# EAGLE schematic Shield_v1 (EAGLE 7.6.0)
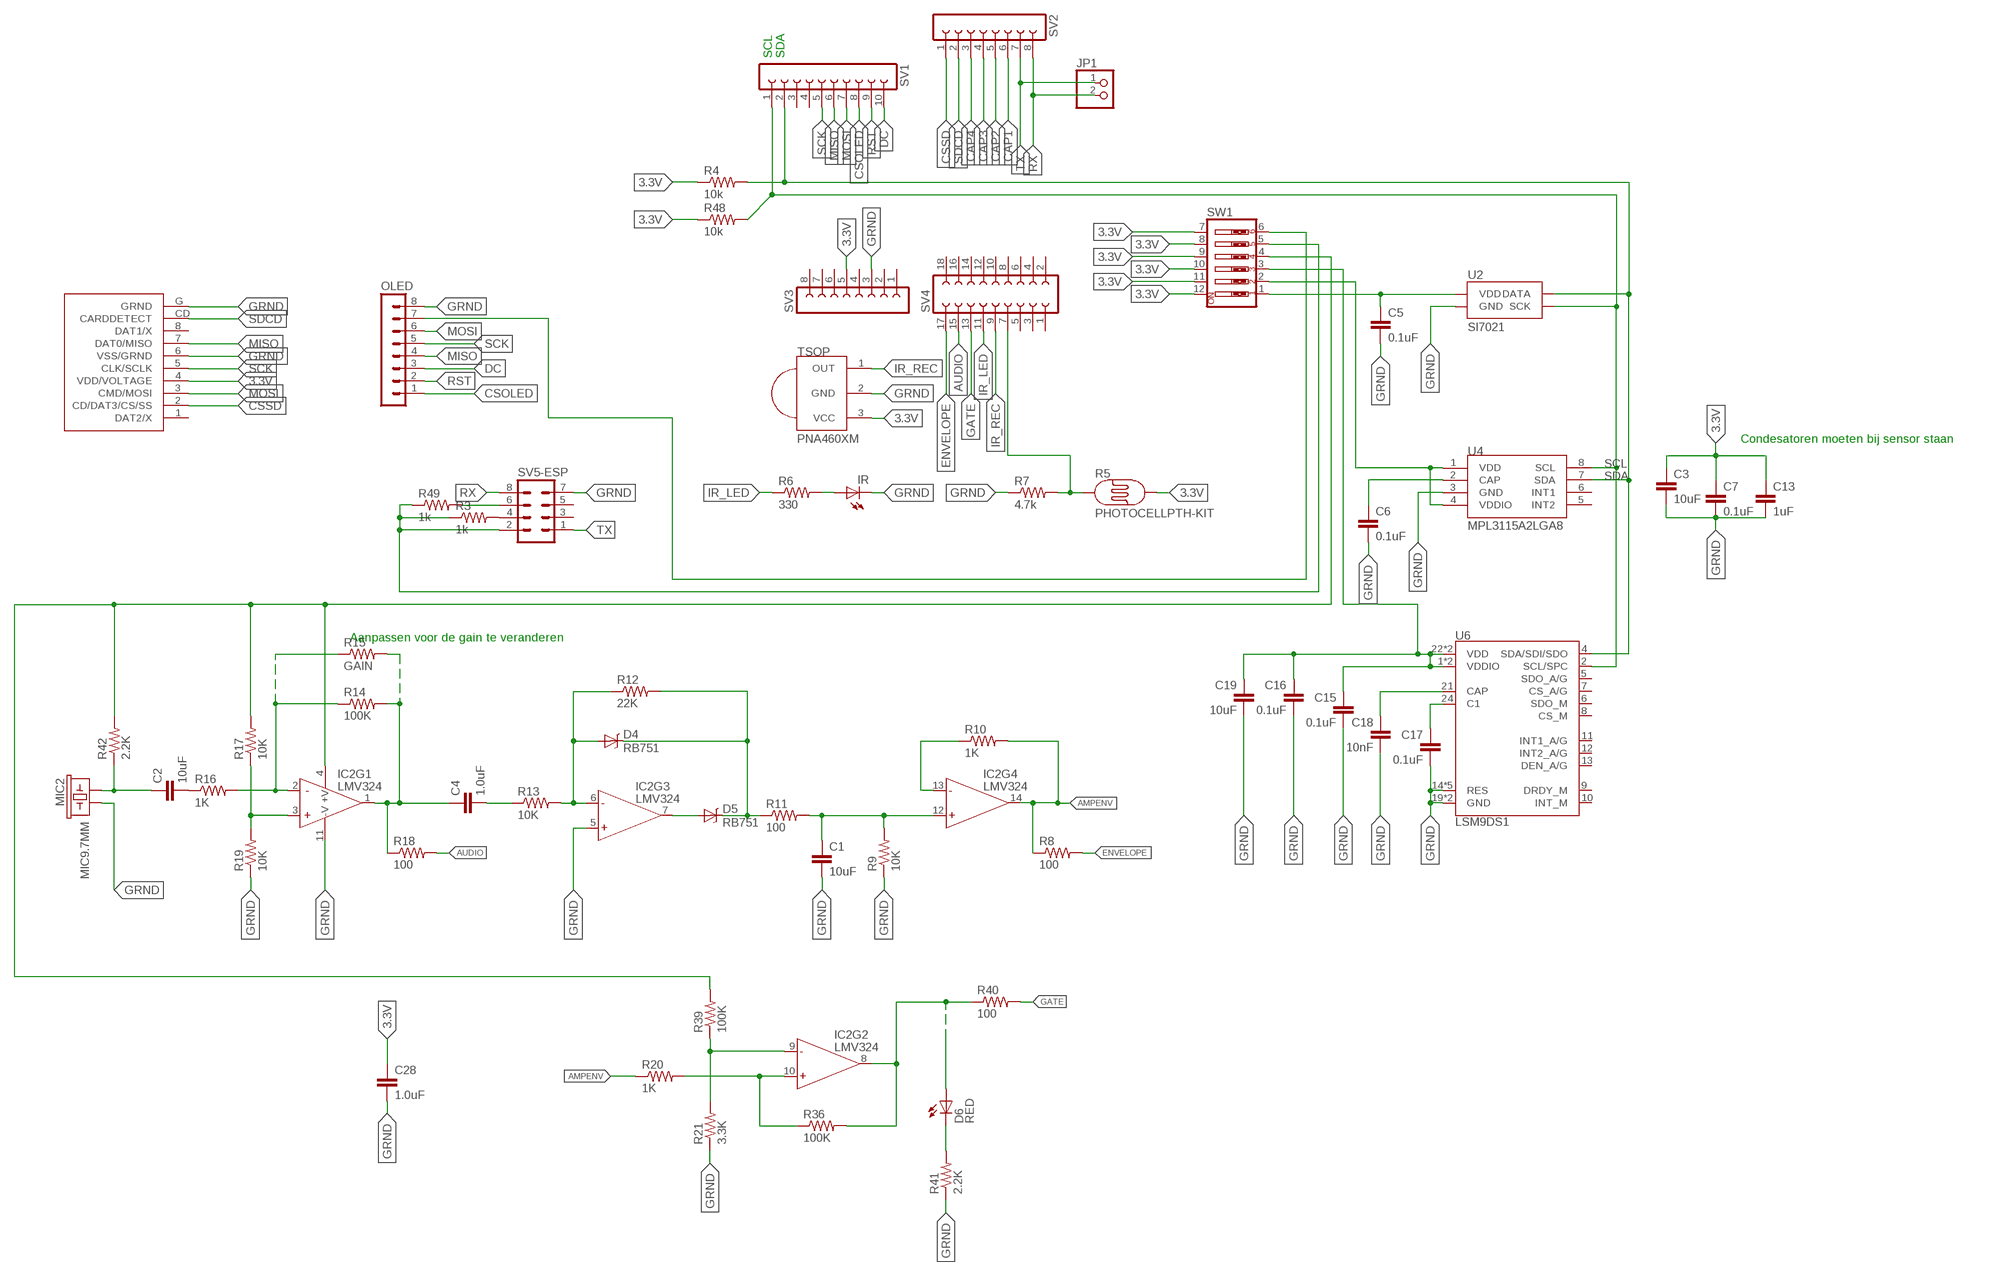
[diagram p0: schematic, sheet 1]

## Parts
C1  10uF  C-EUC1206  [C1206]
C2  10uF  C-EUC1206  [C1206]
C3  10uF  C-EUC1206  [C1206]
C4  1.0uF  C-EUC1206  [C1206]
C5  0.1uF  C-EUC1206  [C1206]
C6  0.1uF  C-EUC1206  [C1206]
C7  0.1uF  C-EUC1206  [C1206]
C13  1uF  C-EUC1206  [C1206]
C15  0.1uF  C-EUC1206  [C1206]
C16  0.1uF  C-EUC1206  [C1206]
C17  0.1uF  C-EUC1206  [C1206]
C18  10nF  C-EUC1206  [C1206]
C19  10uF  C-EUC1206  [C1206]
C28  1.0uF  C-EUC1206  [C1206]
D4  RB751  [SOD-523]
D5  RB751  [SOD-523]
D6  RED  LED3MM  [LED3MM]
IC2  LMV324  [SO014]
IR  LED5MM  [LED5MM]
JP1  PINHD-1X2  [1X02]
MIC2  MIC9.7MM  [MIC-9.7MM]
OLED  MA08-1  [MA08-1]
R3  1k  R-US_R1206  [R1206]
R4  10k  R-US_R1206  [R1206]
R5  PHOTOCELLPTH-KIT  [PHOTOCELL-KIT]
R6  330  R-US_R1206  [R1206]
R7  4.7k  R-US_R1206  [R1206]
R8  100  R-US_R1206  [R1206]
R9  10K  R-US_R1206  [R1206]
R10  1K  R-US_R1206  [R1206]
R11  100  R-US_R1206  [R1206]
R12  22K  R-US_R1206  [R1206]
R13  10K  R-US_R1206  [R1206]
R14  100K  R-US_R1206  [R1206]
R15  GAIN  R-US_R1206  [R1206]
R16  1K  R-US_R1206  [R1206]
R17  10K  R-US_R1206  [R1206]
R18  100  R-US_R1206  [R1206]
R19  10K  R-US_R1206  [R1206]
R20  1K  R-US_R1206  [R1206]
R21  3.3K  R-US_R1206  [R1206]
R36  100K  R-US_R1206  [R1206]
R39  100K  R-US_R1206  [R1206]
R40  100  R-US_R1206  [R1206]
R41  2.2K  R-US_R1206  [R1206]
R42  2.2K  R-US_R1206  [R1206]
R48  10k  R-US_R1206  [R1206]
R49  1k  R-US_R1206  [R1206]
SV1  FE10-1  [FE10]
SV2  FE08-1  [FE08]
SV3  FE08-1  [FE08]
SV4  FE09-2  [FE09-2]
SV5-ESP  MA04-2  [MA04-2]
SW1  SW_DIP-6  [EDG-06]
TSOP  PNA460XM  [PNA460XM]
U2  SI7021  [SI7021]
U4  MPL3115A2LGA8  [LGA8]
U6  LSM9DS1  [LGA24-8X4]
U$1  SDCARD  [SD_CARD]

## Nets
3.3V: C3.1 C7.1 C13.1 C28.1 R4.1 R5.2 R48.1 SV3.5 SW1.7 SW1.8 SW1.9 SW1.10 SW1.11 SW1.12 TSOP.3(VCC) U$1.4(VDD/VOLTAGE)
20: SW1.2 U4.1(VDD) U4.4(VDDIO)
21: C15.1 C16.1 C19.1 SW1.3 U6.1(VDDIO) U6.3(VDDIO) U6.22(VDD) U6.23(VDD)
23: IC2.4(+V) R17.2 R39.2 R42.2 SW1.4
24: R3.1 R49.1 SV5-ESP.2 SW1.5
AMPENV: IC2.14(OUT) R8.1 R10.2 R20.1
AUDIO: R5.1 R7.2 R18.2 SV4.7 SV4.15
C1: C17.1 U6.24(C1)
CAP1: SV2.6
CAP2: C18.1 SV2.5 U6.21(CAP)
CAP3: SV2.4
CAP4: SV2.3
CSOLED: OLED.1 SV1.8
CSSD: SV2.1 U$1.2(CD/DAT3/CS/SS)
DC: OLED.3 SV1.10
ENVELOPE: R8.2 SV4.17
GATE: R40.2 SV4.13
GRND: C1.2 C3.2 C5.2 C6.2 C7.2 C13.2 C15.2 C16.2 C17.2 C18.2 C19.2 C28.2 IC2.5(+IN) IC2.11(-V) IR.K(C) MIC2.2 OLED.8 R7.1 R9.1 R19.1 R21.1 R41.1 SV3.3 SV5-ESP.7 TSOP.2(GND) U2.GND U4.3(GND) U6.14(RES) U6.15(RES) U6.16(RES) U6.17(RES) U6.18(RES) U6.19(GND) U6.20(GND) U$1.6(VSS/GRND) U$1.G(GRND)
IR_LED: R6.1 SV4.11
IR_REC: SV4.9 TSOP.1(OUT)
MISO: OLED.4 SV1.6 U$1.7(DAT0/MISO)
MOSI: OLED.6 SV1.7 U$1.3(CMD/MOSI)
N$: C4.1 IC2.1(OUT) R14.2 R15.2 R18.1
N$1: C6.1 U4.2(CAP)
N$2: IR.A R6.2
N$3: C2.1 MIC2.1 R42.1
N$4: R49.2 SV5-ESP.6
N$6: R3.2 SV5-ESP.4
N$8: C5.1 SW1.1 U2.VDD
N$9: OLED.7 SW1.6
N$14: IC2.3(+IN) R17.1 R19.2
N$18: IC2.2(-IN) R14.1 R15.1 R16.2
N$19: C2.2 R16.1
N$20: C4.2 R13.1
N$21: D4.A IC2.6(-IN) R12.1 R13.2
N$22: D5.A IC2.7(OUT)
N$23: D4.C D5.C R11.1 R12.2
N$24: C1.1 IC2.12(+IN) R9.2 R11.2
N$25: IC2.13(-IN) R10.1
N$26: IC2.9(-IN) R21.2 R39.1
N$27: IC2.10(+IN) R20.2 R36.1
N$28: D6.A IC2.8(OUT) R36.2 R40.1
N$29: D6.K(C) R41.2
RST: OLED.2 SV1.9
RX: JP1.2 SV2.8 SV5-ESP.8
SCK: OLED.5 SV1.5 U$1.5(CLK/SCLK)
SCL: R48.2 SV1.1 U2.SCK U4.8(SCL) U6.2(SCL/SPC)
SDA: R4.2 SV1.2 U2.DATA U4.7(SDA) U6.4(SDA/SDI/SDO)
SDCD: SV2.2 U$1.CD(CARDDETECT)
TX: JP1.1 SV2.7 SV5-ESP.1
Unconnected: SV1.3 SV1.4 SV3.1 SV3.2 SV3.4 SV3.6 SV3.7 SV3.8 SV4.1 SV4.2 SV4.3 SV4.4 SV4.5 SV4.6 SV4.8 SV4.10 SV4.12 SV4.14 SV4.16 SV4.18 SV5-ESP.3 SV5-ESP.5 U4.5(INT2) U4.6(INT1) U6.5(SDO_A/G) U6.6(SDO_M) U6.7(CS_A/G) U6.8(CS_M) U6.9(DRDY_M) U6.10(INT_M) U6.11(INT1_A/G) U6.12(INT2_A/G) U6.13(DEN_A/G) U$1.1(DAT2/X) U$1.8(DAT1/X)

## Notes on the sheet
- SCL | SDA
- Condesatoren moeten bij sensor staan
- Aanpassen voor de gain te veranderen

## Library data of the parts
C1-C7 C13 C15-C19 C28 = rcl:C-EU: CAPACITOR, European symbol
D4 D5 = SparkFun-DiscreteSemi:RB751: 40V 120mA SOD-523 Schottky DIO-11018; PROD_ID: DIO-11018
D6 = led:LED: LED
IC2 = SparkFun-AnalogIC:LMV324: Jellybean quad op-amp; PROD_ID: IC-08227
IR = adafruit:LED: LED
JP1 = pinhead:PINHD-1X2: PIN HEADER
MIC2 = SparkFun-Sensors:MIC: Omni-directional electret microphone. 9.7mm standard diameter.; PROD_ID: COMP-08856
OLED = con-lstb:MA08-1: PIN HEADER; OC_FARNELL: unknown; OC_NEWARK: unknown
R3 R4 R6-R21 R36 R39-R42 R48 R49 = adafruit:R-US_: RESISTOR, American symbol
R5 = SparkFun-Sensors:PHOTOCELL: CdS photoresistor. This is a low cost way to detect light levels. Resistance decreases with more incoming light. SparkFun SKU: SEN-09088
SV1 = con-lsta:FE10-1: FEMALE HEADER; OC_FARNELL: unknown; OC_NEWARK: unknown
SV2 SV3 = con-lsta:FE08-1: FEMALE HEADER; OC_FARNELL: unknown; OC_NEWARK: unknown
SV4 = con-lsta:FE09-2: FEMALE HEADER; OC_FARNELL: unknown; OC_NEWARK: unknown
SV5-ESP = con-lstb:MA04-2: PIN HEADER; OC_FARNELL: unknown; OC_NEWARK: unknown
SW1 = special:SW_DIP-6: DIP SWITCH
TSOP = adafruit:PNA460XM: IR 38KHz receiver PNA4602 and related receivers http://www.ladyada.net/library/pcb/eaglelibrary.html
U2 = SparkFun-Sensors:SI7021: The Si7021 is an I2C Humidity and Temperature Sensor; PROD_ID: IC-13093
U4 = SparkFun-Sensors:MPL3115A2: Altimeter/Pressure Sensor, I2C, 1.95V-3.6V supply, 50 to 110kPa
U6 = LSM9DS1_temp:LSM9DS1: LSM9DS1 3D accelerometer, gyroscope & magnetometer The LSM9DS1 is a system-in-package featuring a 3D digital linear acceleration sensor, a 3D digital angular rate sensor, and a 3D digital magnetic sensor. The LSM9DS1 has a linear acceleration full scale of ±2g/±4g/±8/±16 g, a magnetic field full scale of ±4/±8/±12/±16 gauss and an angular rate of ±245/±500/±2000 dps. The LSM9DS1 includes an I2 C serial bus interface supporting standard and fast mode (100 kHz and 400 kHz) and an SPI serial standard interface. Magnetic, accelerometer and gyroscope sensing can be enabled or set in power-down mode separately for smart power management. The LSM9DS1 is available in a plastic land grid array package (LGA) and it is guaranteed to operate over an extended temperature range from -40 °C to +85 °C.; PROD_ID: IC-12536
U$1 = ProjectEP:SDCARD

## Net classes
0 default: clearance 0.205 mm